# EAGLE schematic untitled (EAGLE 7.5.0)
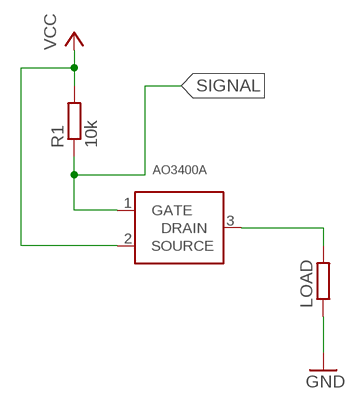
[diagram p0: schematic, sheet 1]

## Parts
AO3401_P-MOSFET  AO3401_P-MOSFET  AO3400A  [SOT-23]
LOAD  R-EU_0204/2V  [0204V]
R1  10k  R-EU_0204/2V  [0204V]

## Nets
GND: LOAD.1
N$2: AO3401_P-MOSFET.3(DRAIN) LOAD.2
SIGNAL: AO3401_P-MOSFET.1(GATE) R1.1
VCC: AO3401_P-MOSFET.2(SOURCE) R1.2

## Library data of the parts
AO3401_P-MOSFET = smd-footprints:AO3400A
LOAD R1 = resistor:R-EU_: RESISTOR, European symbol